# Altium schematic sheet 2015-02-06_01-57-191.schdoc
size 283 x 191 mm; SheetNumber: 1; SheetTotal: 1
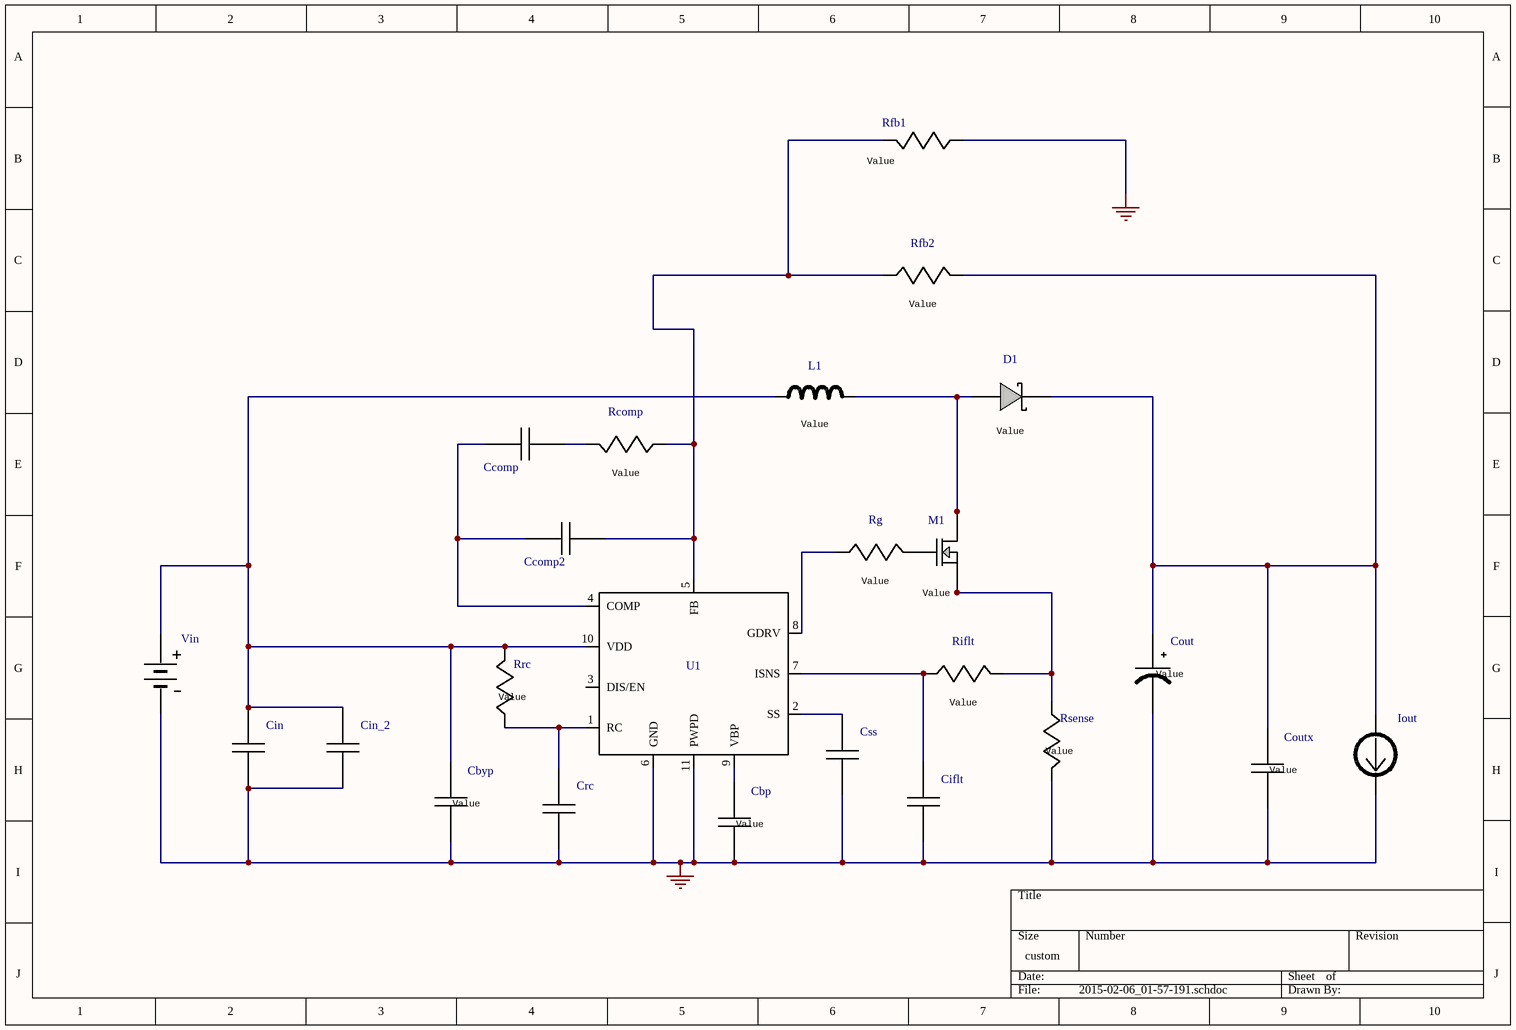
[diagram p0: 2015-02-06_01-57-191.schdoc]

## Parts
Cbp  C1608X5R1C105K  [1608]  (value not drawn)
Cbyp  EMK212B7474KD-T  [0805]  (value not drawn)
Ccomp  CC0805KRX7R9BB27  [0805]  (value not drawn)
Ccomp2  CC0805JRNPO9BN10  [0805]  (value not drawn)
Ciflt  CC0805JRNPO9BN15  [0805]  (value not drawn)
Cin  GRM21BR61E475MA1  [0805]  (value not drawn)
Cin_2  GRM21BR61E475MA1  [0805]  (value not drawn)
Cout  35SVPF82M  [CAPSMT_62_E12]  (value not drawn)
Coutx  GMK212B7105KG-T  [0805]  (value not drawn)
Crc  CC0805JRNPO9BN10  [0805]  (value not drawn)
Css  GRM155R61A683KA0  [0402]  (value not drawn)
D1  B240A-13-F  [SMA]  (value not drawn)
Iout  WB_CURRENT_LOAD  (value not drawn)
L1  SRR1210-220M  [SRR1210]  (value not drawn)
M1  CSD17551Q5A  [TRANS_NexFET_Q5A]  (value not drawn)
Rcomp  CRCW040256K2FKED  [0402]  (value not drawn)
Rfb1  CRCW04021K40FKED  [0402]  (value not drawn)
Rfb2  RR1220P-473-D  [0805]  (value not drawn)
Rg  CRCW040217R8FKED  [0402]  (value not drawn)
Riflt  CRCW04021K00FKED  [0402]  (value not drawn)
Rrc  CRCW0402316KFKED  [0402]  (value not drawn)
Rsense  CSR1206FK25L0  [1206]  (value not drawn)
U1  TPS40210DGQR  [S-PDSO-G10]  (value not drawn)
Vin  WB_BATTERY  (value not drawn)

## Nets
0: Cbp.2 Cbyp.2 Ciflt.2 Cin.2 Cin_2.2 Cout.2(-) Coutx.2 Crc.2 Css.2 Iout.2(-) Rfb1.2 Rsense.1 U1.6(GND) U1.11(PWPD) Vin.2(-)
NetCbp_1: Cbp.1 U1.9(VBP)
NetCbyp_1: Cbyp.1 Cin.1 Cin_2.1 L1.1 Rrc.1 U1.10(VDD) Vin.1(+)
NetCcomp2_2: Ccomp2.2 Rcomp.2 Rfb1.1 Rfb2.2 U1.5(FB)
NetCcomp_1: Ccomp.1 Ccomp2.1 U1.4(COMP)
NetCcomp_2: Ccomp.2 Rcomp.1
NetCiflt_1: Ciflt.1 Riflt.2 U1.7(ISNS)
NetCout_1: Cout.1(+) Coutx.1 D1.1(K) Iout.1(+) Rfb2.1
NetCrc_1: Crc.1 Rrc.2 U1.1(RC)
NetCss_1: Css.1 U1.2(SS)
NetD1_2: D1.2(A) L1.2 M1.5(Drain) M1.6(Drain) M1.7(Drain) M1.8(Drain) M1.9(Drain)
NetM1_1: M1.1(Source) M1.2(Source) M1.3(Source) Riflt.1 Rsense.2
NetM1_4: M1.4(Gate) Rg.1
NetRg_2: Rg.2 U1.8(GDRV)

Not connected (* = marked no-connect by the designer): U1 3(DIS/EN)

## Library data of the parts
Cbp = C1608X5R1C105K: Imported; Vendor: TDK; Value: Value; Manufacturer_Part_Number: C1608X5R1C105K; Manufacturer_Name: TDK; RefDes: RefDes; TYPE: TYPE
Cbyp = EMK212B7474KD-T: Imported; Vendor: Taiyo Yuden; Value: Value; Manufacturer_Part_Number: EMK212B7474KD-T; Manufacturer_Name: Taiyo Yuden; RefDes: RefDes; TYPE: TYPE
Ccomp = CC0805KRX7R9BB27: Imported; Manufacturer_Part_Number: CC0805KRX7R9BB272; Vendor: Yageo America; Value: Value; Manufacturer_Name: Yageo America; RefDes: RefDes; TYPE: TYPE
Ccomp2 Crc = CC0805JRNPO9BN10: Imported; Manufacturer_Part_Number: CC0805JRNPO9BN101; Vendor: Yageo America; Value: Value; Manufacturer_Name: Yageo America; RefDes: RefDes; TYPE: TYPE
Ciflt = CC0805JRNPO9BN15: Imported; Manufacturer_Part_Number: CC0805JRNPO9BN151; Vendor: Yageo America; Value: Value; Manufacturer_Name: Yageo America; RefDes: RefDes; TYPE: TYPE
Cin Cin_2 = GRM21BR61E475MA1: Imported; Manufacturer_Part_Number: GRM21BR61E475MA12L; Vendor: MuRata; Value: Value; Manufacturer_Name: MuRata; RefDes: RefDes; TYPE: TYPE
Cout = 35SVPF82M: Imported; Vendor: Panasonic; Value: Value; Manufacturer_Part_Number: 35SVPF82M; Manufacturer_Name: Panasonic; RefDes: RefDes; TYPE: TYPE
Coutx = GMK212B7105KG-T: Imported; Vendor: Taiyo Yuden; Value: Value; Manufacturer_Part_Number: GMK212B7105KG-T; Manufacturer_Name: Taiyo Yuden; RefDes: RefDes; TYPE: TYPE
Css = GRM155R61A683KA0: Imported; Manufacturer_Part_Number: GRM155R61A683KA01D; Vendor: MuRata; Value: Value; Manufacturer_Name: MuRata; RefDes: RefDes; TYPE: TYPE
D1 = B240A-13-F: Imported; Vendor: Diodes Inc.; Value: Value; Manufacturer_Part_Number: B240A-13-F; Manufacturer_Name: Diodes Inc.; RefDes: RefDes; Type: Type
Iout = WB_CURRENT_LOAD: Imported; PowerPortType: POWER_GROUND; Value: Value; Manufacturer_Part_Number: WB_CURRENT_LOAD; Manufacturer_Name: WB_CURRENT_LOAD; RefDes: RefDes; TYPE: TYPE
L1 = SRR1210-220M: Imported; Vendor: Bourns; Value: Value; Manufacturer_Part_Number: SRR1210-220M; Manufacturer_Name: Bourns; RefDes: RefDes; TYPE: TYPE
M1 = CSD17551Q5A: Imported; Vendor: Texas Instruments; Value: Value; Manufacturer_Part_Number: CSD17551Q5A; Manufacturer_Name: Texas Instruments; RefDes: RefDes; TYPE: TYPE
Rcomp = CRCW040256K2FKED: Imported; Vendor: Vishay-Dale; Value: Value; Manufacturer_Part_Number: CRCW040256K2FKED; Manufacturer_Name: Vishay-Dale; RefDes: RefDes; TYPE: TYPE
Rfb1 = CRCW04021K40FKED: Imported; Vendor: Vishay-Dale; Value: Value; Manufacturer_Part_Number: CRCW04021K40FKED; Manufacturer_Name: Vishay-Dale; RefDes: RefDes; TYPE: TYPE
Rfb2 = RR1220P-473-D: Imported; Vendor: Susumu Co Ltd; Value: Value; Manufacturer_Part_Number: RR1220P-473-D; Manufacturer_Name: Susumu Co Ltd; RefDes: RefDes; TYPE: TYPE
Rg = CRCW040217R8FKED: Imported; Vendor: Vishay-Dale; Value: Value; Manufacturer_Part_Number: CRCW040217R8FKED; Manufacturer_Name: Vishay-Dale; RefDes: RefDes; TYPE: TYPE
Riflt = CRCW04021K00FKED: Imported; Vendor: Vishay-Dale; Value: Value; Manufacturer_Part_Number: CRCW04021K00FKED; Manufacturer_Name: Vishay-Dale; RefDes: RefDes; TYPE: TYPE
Rrc = CRCW0402316KFKED: Imported; Vendor: Vishay-Dale; Value: Value; Manufacturer_Part_Number: CRCW0402316KFKED; Manufacturer_Name: Vishay-Dale; RefDes: RefDes; TYPE: TYPE
Rsense = CSR1206FK25L0: Imported; Vendor: Stackpole Electronics Inc; Value: Value; Manufacturer_Part_Number: CSR1206FK25L0; Manufacturer_Name: Stackpole Electronics Inc; RefDes: RefDes; TYPE: TYPE
U1 = TPS40210DGQR: Imported; Vendor: Texas Instruments; Value: Value; Manufacturer_Part_Number: TPS40210DGQR; Manufacturer_Name: Texas Instruments; RefDes: RefDes; TYPE: TYPE
Vin = WB_BATTERY: Imported; PowerPortType: POWER_GROUND; Value: Value; Manufacturer_Part_Number: WB_BATTERY; Manufacturer_Name: WB_BATTERY; RefDes: RefDes; TYPE: TYPE